# Altium schematic sheet theswitch.SchDoc
size A3
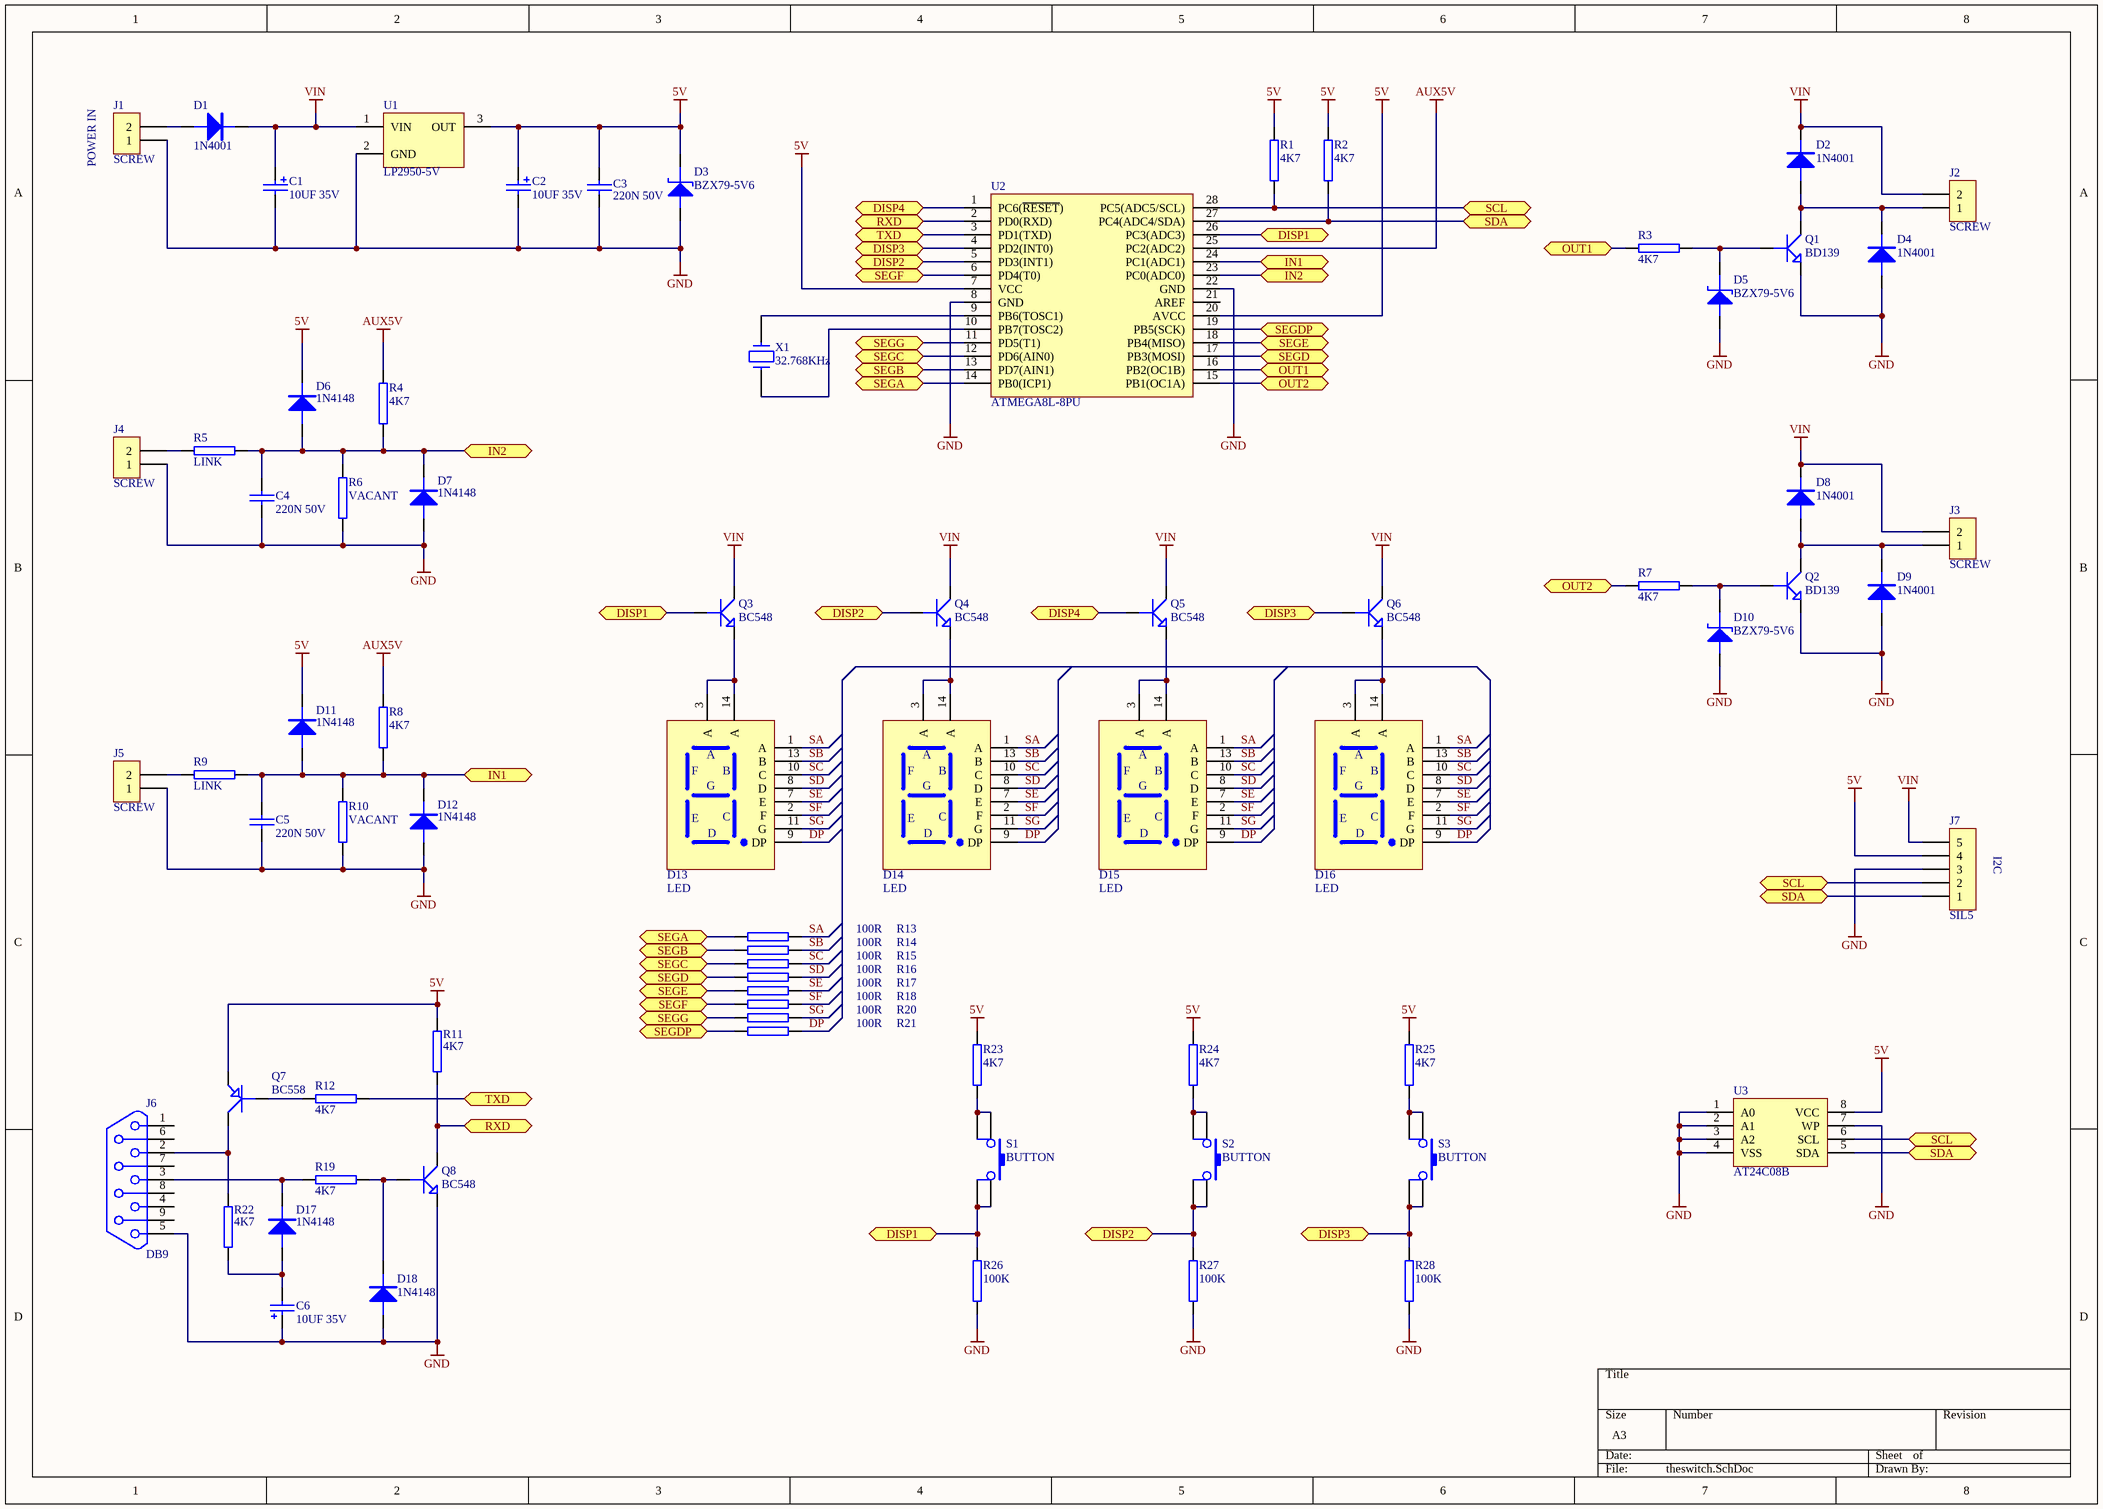
[diagram p0: theswitch.SchDoc]

## Parts
C1  10UF 35V  [RADIAL01P]
C2  10UF 35V  [RADIAL01P]
C3  220N 50V  [RAD02]
C4  220N 50V  [RAD02]
C5  220N 50V  [RAD02]
C6  10UF 35V  [RADIAL01P]
D1  1N4001  [DO35S]
D2  1N4001  [DO35S]
D3  BZX79-5V6  [DO35S]
D4  1N4001  [DO35S]
D5  BZX79-5V6  [DO35S]
D6  1N4148  [DO35S]
D7  1N4148  [DO35S]
D8  1N4001  [DO35S]
D9  1N4001  [DO35S]
D10  BZX79-5V6  [DO35S]
D11  1N4148  [DO35S]
D12  1N4148  [DO35S]
D13  LED  [TOS4102]
D14  LED  [TOS4102]
D15  LED  [TOS4102]
D16  LED  [TOS4102]
D17  1N4148  [DO35S]
D18  1N4148  [DO35S]
J1  SCREW  [MKD500S2]
J2  SCREW  [MKD500S2]
J3  SCREW  [MKD500S2]
J4  SCREW  [MKD500S2]
J5  SCREW  [MKD500S2]
J6  DB9  [DB9S]
J7  SIL5  [SIL5]
Q1  BD139  [TO220V]
Q2  BD139  [TO220V]
Q3  BC548  [TO92]
Q4  BC548  [TO92]
Q5  BC548  [TO92]
Q6  BC548  [TO92]
Q7  BC558  [TO92]
Q8  BC548  [TO92]
R1  4K7  [AXIAL04]
R2  4K7  [AXIAL04]
R3  4K7  [AXIAL04]
R4  4K7  [AXIAL04]
R5  LINK  [AXIAL04]
R6  VACANT  [AXIAL04]
R7  4K7  [AXIAL04]
R8  4K7  [AXIAL04]
R9  LINK  [AXIAL04]
R10  VACANT  [AXIAL04]
R11  4K7  [AXIAL04]
R12  4K7  [AXIAL04]
R13  100R  [AXIAL04]
R14  100R  [AXIAL04]
R15  100R  [AXIAL04]
R16  100R  [AXIAL04]
R17  100R  [AXIAL04]
R18  100R  [AXIAL04]
R19  4K7  [AXIAL04]
R20  100R  [AXIAL04]
R21  100R  [AXIAL04]
R22  4K7  [AXIAL04]
R23  4K7  [AXIAL04]
R24  4K7  [AXIAL04]
R25  4K7  [AXIAL04]
R26  100K  [AXIAL04]
R27  100K  [AXIAL04]
R28  100K  [AXIAL04]
S1  BUTTON  [SWPB]
S2  BUTTON  [SWPB]
S3  BUTTON  [SWPB]
U1  LP2950-5V  [TO92]
U2  ATMEGA8L-8PU  [DIP28N]
U3  AT24C08B  [DIP8]
X1  32.768KHz  [RADIAL01]

## Ports
DISP1, DISP2, DISP3, DISP4, IN1, IN2, OUT1, OUT2, RXD, SCL (bidir), SDA (bidir), SEGA, SEGB, SEGC, SEGD, SEGDP, SEGE, SEGF, SEGG, TXD

## Nets
5V: C2.1 C3.1 D3.2(K) D6.2(K) D11.2(K) J7.4 Q7.1(E) R1.2 R2.2 R11.2 R23.2 R24.2 R25.2 U1.3(OUT) U2.7(VCC) U2.20(AVCC) U3.8(VCC)
AUX5V: R4.1 R8.1 U2.25(PC2(ADC2))
GND: C1.2 C2.2 C3.2 C4.2 C5.2 C6.1 D3.1(A) D4.1(A) D5.1(A) D7.1(A) D9.1(A) D10.1(A) D12.1(A) D18.1(A) J1.1 J4.1 J5.1 J6.5 J7.3 Q1.1(E) Q2.1(E) Q8.1(E) R6.2 R10.2 R26.1 R27.1 R28.1 U1.2(GND) U2.8(GND) U2.22(GND) U3.1(A0) U3.2(A1) U3.3(A2) U3.4(VSS) U3.7(WP)
VIN: C1.1 D1.2(K) D2.2(K) D8.2(K) J2.2 J3.2 J7.5 Q3.3(C) Q4.3(C) Q5.3(C) Q6.3(C) U1.1(VIN)
DISP1: Q3.2(B) R26.2 S1.2 S1.4 U2.26(PC3(ADC3)) ; port DISP1
DISP2: Q4.2(B) R27.2 S2.2 S2.4 U2.5(PD3(INT1)) ; port DISP2
DISP3: Q6.2(B) R28.2 S3.2 S3.4 U2.4(PD2(INT0)) ; port DISP3
DISP4: Q5.2(B) U2.1(PC6(~{RESET})) ; port DISP4
DP: D13.9(DP) D14.9(DP) D15.9(DP) D16.9(DP) R21.2
IN1: C5.1 D11.1(A) D12.2(K) R8.2 R9.2 R10.1 U2.24(PC1(ADC1)) ; port IN1
IN2: C4.1 D6.1(A) D7.2(K) R4.2 R5.2 R6.1 U2.23(PC0(ADC0)) ; port IN2
OUT1: R3.2 U2.16(PB2(OC1B)) ; port OUT1
OUT2: R7.2 U2.15(PB1(OC1A)) ; port OUT2
RXD: Q8.3(C) R11.1 U2.2(PD0(RXD)) ; port RXD
SA: D13.1(A) D14.1(A) D15.1(A) D16.1(A) R13.2
SB: D13.13(B) D14.13(B) D15.13(B) D16.13(B) R14.2
SC: D13.10(C) D14.10(C) D15.10(C) D16.10(C) R15.2
SCL: J7.2 R1.1 U2.28(PC5(ADC5/SCL)) U3.6(SCL) ; port SCL
SD: D13.8(D) D14.8(D) D15.8(D) D16.8(D) R16.2
SDA: J7.1 R2.1 U2.27(PC4(ADC4/SDA)) U3.5(SDA) ; port SDA
SE: D13.7(E) D14.7(E) D15.7(E) D16.7(E) R17.2
SEGA: R13.1 U2.14(PB0(ICP1)) ; port SEGA
SEGB: R14.1 U2.13(PD7(AIN1)) ; port SEGB
SEGC: R15.1 U2.12(PD6(AIN0)) ; port SEGC
SEGD: R16.1 U2.17(PB3(MOSI)) ; port SEGD
SEGDP: R21.1 U2.19(PB5(SCK)) ; port SEGDP
SEGE: R17.1 U2.18(PB4(MISO)) ; port SEGE
SEGF: R18.1 U2.6(PD4(T0)) ; port SEGF
SEGG: R20.1 U2.11(PD5(T1)) ; port SEGG
SF: D13.2(F) D14.2(F) D15.2(F) D16.2(F) R18.2
SG: D13.11(G) D14.11(G) D15.11(G) D16.11(G) R20.2
TXD: R12.1 U2.3(PD1(TXD)) ; port TXD
NetC6_2: C6.2 D17.1(A) R22.1
NetD1_1: D1.1(A) J1.2
NetD2_1: D2.1(A) D4.2(K) J2.1 Q1.2(C)
NetD5_2: D5.2(K) Q1.3(B) R3.1
NetD8_1: D8.1(A) D9.2(K) J3.1 Q2.2(C)
NetD10_2: D10.2(K) Q2.3(B) R7.1
NetD13_3: D13.3(A) D13.14(A) Q3.1(E)
NetD14_3: D14.3(A) D14.14(A) Q4.1(E)
NetD15_3: D15.3(A) D15.14(A) Q5.1(E)
NetD16_3: D16.3(A) D16.14(A) Q6.1(E)
NetD17_2: D17.2(K) J6.3 R19.2
NetD18_2: D18.2(K) Q8.2(B) R19.1
NetJ4_2: J4.2 R5.1
NetJ5_2: J5.2 R9.1
NetJ6_2: J6.2 Q7.3(C) R22.2
NetQ7_2: Q7.2(B) R12.2
NetR23_1: R23.1 S1.1 S1.3
NetR24_1: R24.1 S2.1 S2.3
NetR25_1: R25.1 S3.1 S3.3
NetU2_9: U2.9(PB6(TOSC1)) X1.1
NetU2_10: U2.10(PB7(TOSC2)) X1.2

Not connected (* = marked no-connect by the designer): J6 1 4 6 7 8 9; U2 21(AREF)

## Notes on the sheet
- (near J1) POWER IN
- (near J7) I2C

## Library data of the parts
C1 C2 C6 = CAPPOL: CAPACITOR ELECTROLYTIC
C3-C5 = CAPACITOR
D3 D5 D10 = BZX79: ZENER DIODE
D6 D7 D11 D12 D17 D18 = 1N4001
D13-D16 = DISP7SEG: LED DISPLAY 7 SEGMENT
J1-J3 = CON2: CONNECTOR; Text Field1: 2 PIN 2.54MM PITCH SINGLE
J4 J5 = CON2: CONNECTOR
J6 = DB9: CONNECTOR; Text Field1: DB9 FEM 90 DEG
J7 = CON5: CONNECTOR; Text Field1: 5 PIN 2.54MM PITCH SINGLE
R1-R28 = RES: RESISTOR
S1-S3 = BUTTON: PUSH BUTTON SWITCH
U1 = LP2950
U2 = ATMEGA8L-8PU: MICROCONTROLLER
U3 = AT24C08B: I2C 8KBIT EEPROM
X1 = XTAL: CRYSTAL